# EAGLE board Eddy Backplane (EAGLE 9.5.2)
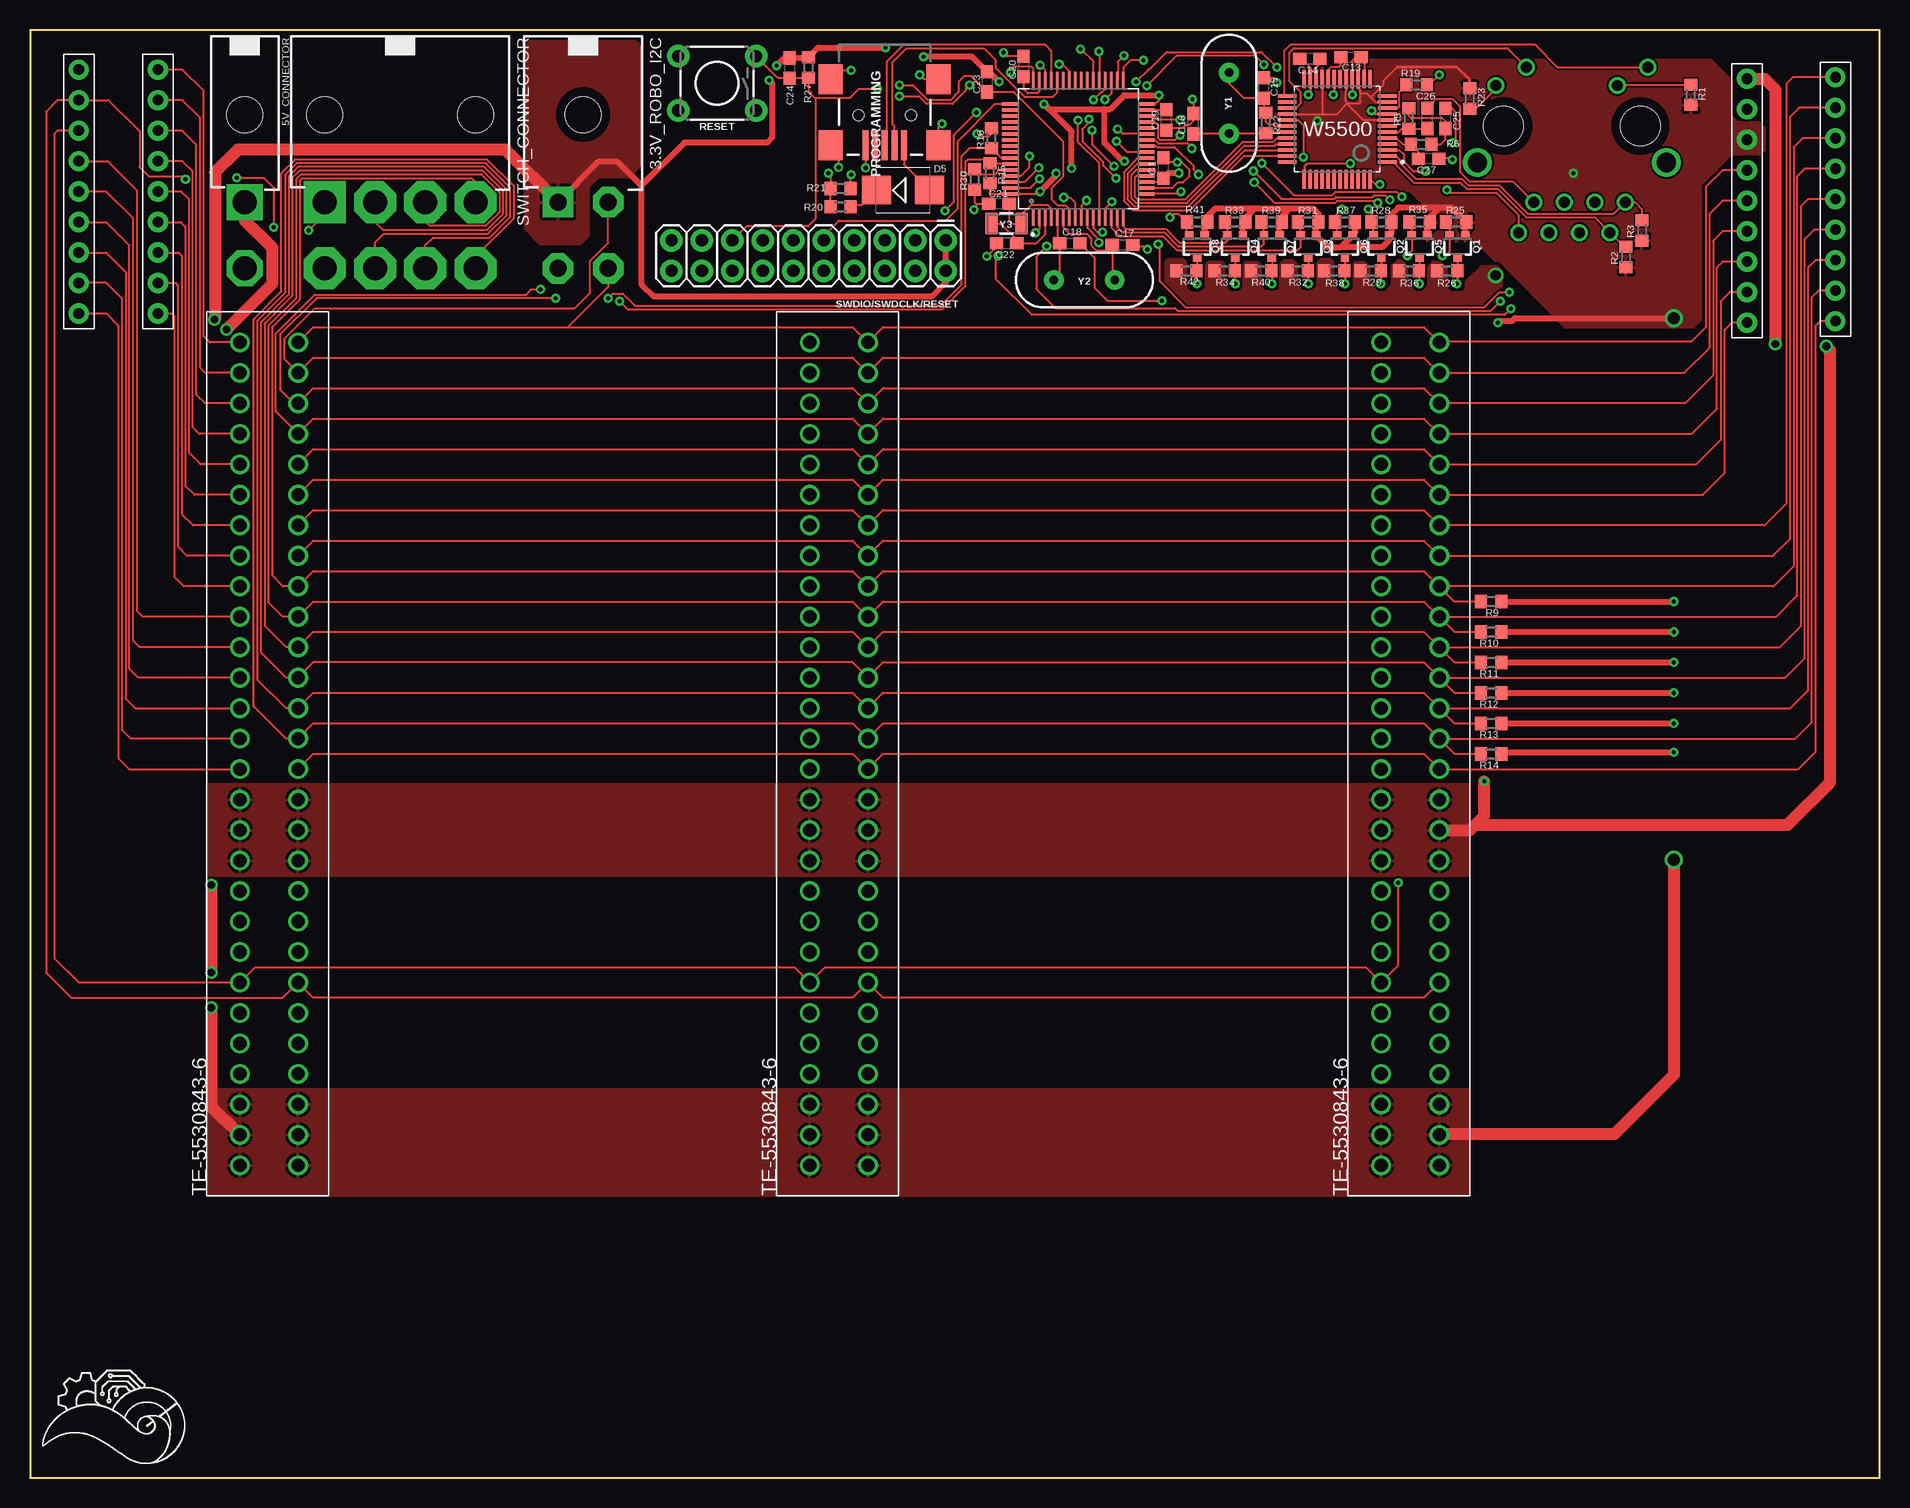
[diagram p3: board, top side]
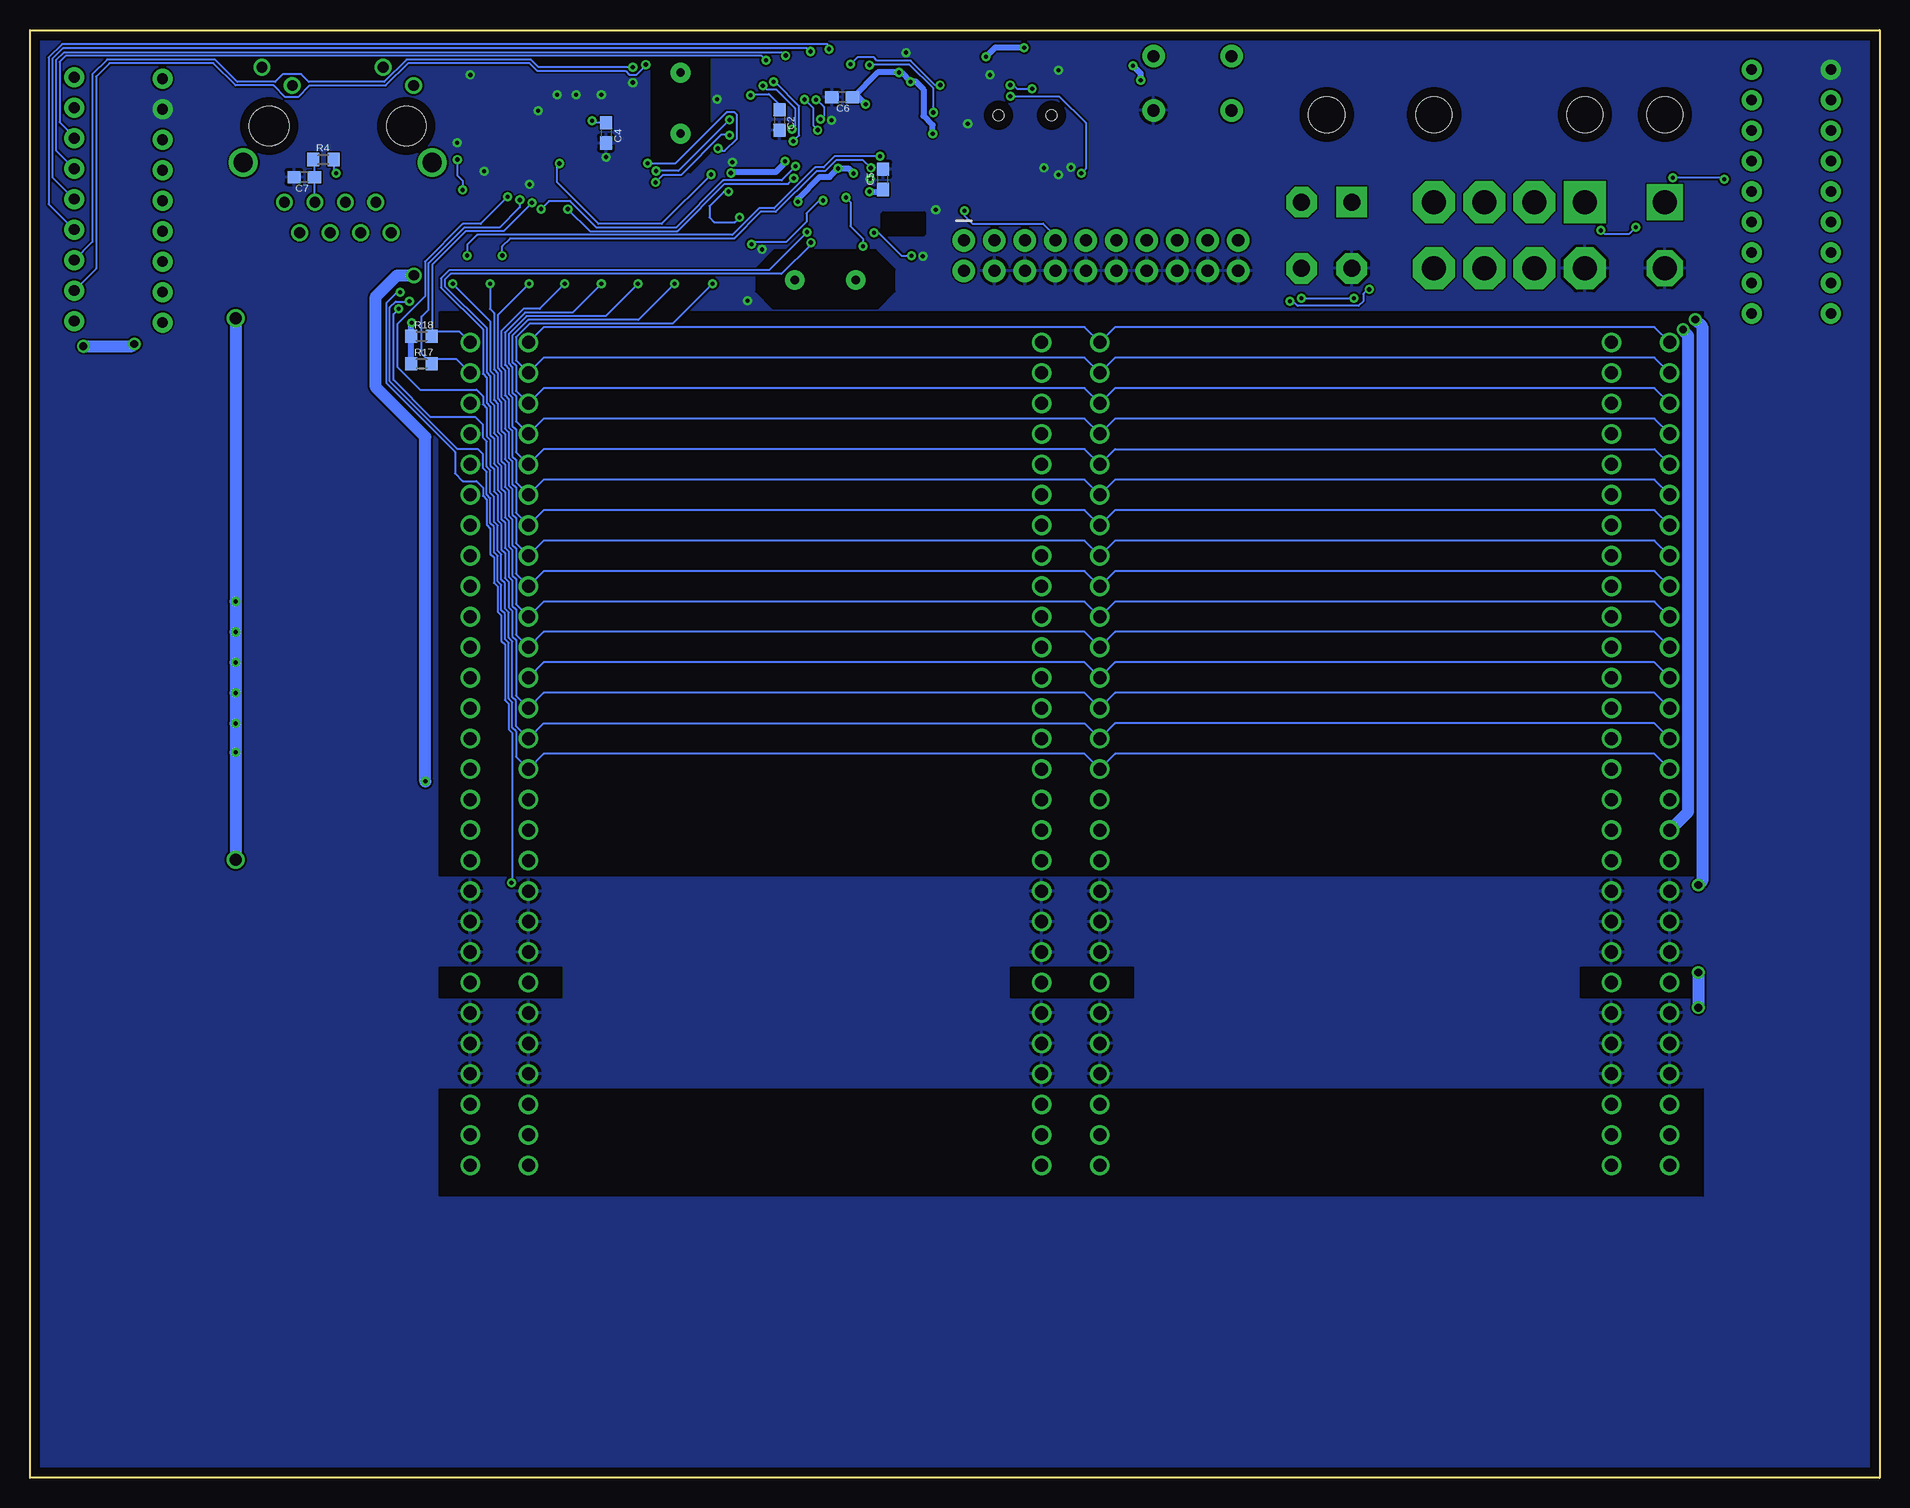
[diagram p4: board, bottom side, seen from below]

Size 154.18 x 120.65 mm. Coordinates in mm from the lower left corner, seen from the top.
Outline: 0,0 154.18,0 154.18,120.65 0,120.65 0,0
Copper layers (1*16): Top 0.035mm / dielectric 1.5mm / Bottom 0.035mm
Design rules "default *": minimum track width 6mil, minimum drill 0.35mm, track to track 6mil, track to pad 6mil, pad to pad 6mil, via to via 6mil, smd to smd 6mil, copper to edge 30mil, drill to drill 6mil, minimum pad ring 10mil, minimum via ring 8mil, stop-mask expansion 4mil, vias tented up to drill 0mil, thermal gap 10mil

## Footprints (pad centres in the part's own frame; a part is rotated, then mirrored left to right if it is on the bottom)
39-30-?04? = drill 1.422 pad 2.54 square: 1 2.095,0 | drill 1.422 pad 2.54 octagon: 2 -2.095,0; 3 2.095,5.512; 4 -2.095,5.512 | hole 3: 0,-7.3
39-30-?02? = drill 2 pad 3 square: 1 0,0 | drill 2 pad 3 octagon: 2 0,5.512 | hole 3: 0,-7.3
C0603 = smd 1.1 x 1: 1 -0.85,0; 2 0.85,0
SMB = smd 2.4 x 2.4: A 2.2,0; C -2.2,0
WIZNET_RB1-125BAG1A = drill 0.9: L1 6.325,-3.38; L2 3.784,-4.899; L3 -3.786,-3.379; L4 -6.325,-4.9 | drill 0.9 pad 1.3: R1 -4.446,6.349; R2 -3.176,8.889; R3 -1.906,6.349; R4 -0.636,8.889; R5 0.634,6.349; R6 1.904,8.889; R7 3.174,6.349; R8 4.444,8.889 | drill 1.6 pad 2.184: S1 -7.876,3.049; S2 7.874,3.049 | hole 3.3: 5.714,-0.001; -5.716,-0.001
USB-MINIB = smd 2.5 x 0.5: D+ 2.5,0; D- 2.5,0.8; GND 2.5,-1.6; ID 2.5,-0.8; VBUS 2.5,1.6 | smd 2.5 x 2: S1 -3,4.5; S2 2.5,4.5; S3 -3,-4.5; S4 2.5,-4.5 | hole 0.9: 0,2.2; 0,-2.2
929852-01-09_1ROW = drill 0.889 pad 1.676: P$1 1.27,1.27; P$2 3.81,1.27; P$3 6.35,1.27; P$4 8.89,1.27; P$5 11.43,1.27; P$6 13.97,1.27; P$7 16.51,1.27; P$8 19.05,1.27; P$9 21.59,1.27
SOT323 = smd 0.7 x 0.7: 1 -0.65,-0.925; 2 0.65,-0.925; 3 0,0.925
R0603 = smd 1 x 1.1: 1 -0.85,0; 2 0.85,0
TACTILE_SWITCH_PTH_6.0MM = drill 1.016 pad 1.88: 1 -3.251,2.261; 2 3.251,2.261; 3 -3.251,-2.261; 4 3.251,-2.261
QFP50P1200X1200X160-64N = smd 1.47 x 0.28: 1 -5.67,3.75; 2 -5.67,3.25; 3 -5.67,2.75; 4 -5.67,2.25; 5 -5.67,1.75; 6 -5.67,1.25; 7 -5.67,0.75; 8 -5.67,0.25; 9 -5.67,-0.25; 10 -5.67,-0.75; 11 -5.67,-1.25; 12 -5.67,-1.75; 13 -5.67,-2.25; 14 -5.67,-2.75; 15 -5.67,-3.25; 16 -5.67,-3.75; 33 5.67,-3.75; 34 5.67,-3.25; 35 5.67,-2.75; 36 5.67,-2.25; 37 5.67,-1.75; 38 5.67,-1.25; 39 5.67,-0.75; 40 5.67,-0.25; 41 5.67,0.25; 42 5.67,0.75; 43 5.67,1.25; 44 5.67,1.75; 45 5.67,2.25; 46 5.67,2.75; 47 5.67,3.25; 48 5.67,3.75 | smd 0.28 x 1.47: 17 -3.75,-5.67; 18 -3.25,-5.67; 19 -2.75,-5.67; 20 -2.25,-5.67; 21 -1.75,-5.67; 22 -1.25,-5.67; 23 -0.75,-5.67; 24 -0.25,-5.67; 25 0.25,-5.67; 26 0.75,-5.67; 27 1.25,-5.67; 28 1.75,-5.67; 29 2.25,-5.67; 30 2.75,-5.67; 31 3.25,-5.67; 32 3.75,-5.67; 49 3.75,5.67; 50 3.25,5.67; 51 2.75,5.67; 52 2.25,5.67; 53 1.75,5.67; 54 1.25,5.67; 55 0.75,5.67; 56 0.25,5.67; 57 -0.25,5.67; 58 -0.75,5.67; 59 -1.25,5.67; 60 -1.75,5.67; 61 -2.25,5.67; 62 -2.75,5.67; 63 -3.25,5.67; 64 -3.75,5.67
2X10 = drill 1.016 pad 1.88: 1 0,0; 2 0,2.54; 3 2.54,0; 4 2.54,2.54; 5 5.08,0; 6 5.08,2.54; 7 7.62,0; 8 7.62,2.54; 9 10.16,0; 10 10.16,2.54; 11 12.7,0; 12 12.7,2.54; 13 15.24,0; 14 15.24,2.54; 15 17.78,0; 16 17.78,2.54; 17 20.32,0; 18 20.32,2.54; 19 22.86,0; 20 22.86,2.54
39-30-?08? = drill 2 pad 3.5 square: 1 6.287,0 | drill 2 pad 3.5 octagon: 2 2.095,0; 3 -2.095,0; 4 -6.287,0; 5 6.287,5.512; 6 2.095,5.512; 7 -2.095,5.512; 8 -6.287,5.512 | hole 3: -6.287,-7.3; 6.287,-7.3
5530843-6-BACKPLANEMATE = drill 1.092: 1 0,4.851; 2 2.54,4.851; 3 5.08,4.851; 4 7.62,4.851; 5 10.16,4.851; 6 12.7,4.851; 7 15.24,4.851; 8 17.78,4.851; 9 20.32,4.851; 10 22.86,4.851; 11 25.4,4.851; 12 27.94,4.851; 13 30.48,4.851; 14 33.02,4.851; 15 35.56,4.851; 16 38.1,4.851; 17 40.64,4.851; 18 43.18,4.851; 19 45.72,4.851; 20 48.26,4.851; 21 50.8,4.851; 22 53.34,4.851; 23 55.88,4.851; 24 58.42,4.851; 25 60.96,4.851; 26 63.5,4.851; 27 66.04,4.851; 28 68.58,4.851; 29 68.58,0; 30 66.04,0; 31 63.5,0; 32 60.96,0; 33 58.42,0; 34 55.88,0; 35 53.34,0; 36 50.8,0; 37 48.26,0; 38 45.72,0; 39 43.18,0; 40 40.64,0; 41 38.1,0; 42 35.56,0; 43 33.02,0; 44 30.48,0; 45 27.94,0; 46 25.4,0; 47 22.86,0; 48 20.32,0; 49 17.78,0; 50 15.24,0; 51 12.7,0; 52 10.16,0; 53 7.62,0; 54 5.08,0; 55 2.54,0; 56 0,0
QFP50P900X900X160-48N = smd 1.56 x 0.28: 1 -4.18,2.75; 2 -4.18,2.25; 3 -4.18,1.75; 4 -4.18,1.25; 5 -4.18,0.75; 6 -4.18,0.25; 7 -4.18,-0.25; 8 -4.18,-0.75; 9 -4.18,-1.25; 10 -4.18,-1.75; 11 -4.18,-2.25; 12 -4.18,-2.75; 25 4.18,-2.75; 26 4.18,-2.25; 27 4.18,-1.75; 28 4.18,-1.25; 29 4.18,-0.75; 30 4.18,-0.25; 31 4.18,0.25; 32 4.18,0.75; 33 4.18,1.25; 34 4.18,1.75; 35 4.18,2.25; 36 4.18,2.75 | smd 0.28 x 1.56: 13 -2.75,-4.18; 14 -2.25,-4.18; 15 -1.75,-4.18; 16 -1.25,-4.18; 17 -0.75,-4.18; 18 -0.25,-4.18; 19 0.25,-4.18; 20 0.75,-4.18; 21 1.25,-4.18; 22 1.75,-4.18; 23 2.25,-4.18; 24 2.75,-4.18; 37 2.75,4.18; 38 2.25,4.18; 39 1.75,4.18; 40 1.25,4.18; 41 0.75,4.18; 42 0.25,4.18; 43 -0.25,4.18; 44 -0.75,4.18; 45 -1.25,4.18; 46 -1.75,4.18; 47 -2.25,4.18; 48 -2.75,4.18
HC49US = drill 0.7 pad 1.651: 1 -2.54,0; 2 2.54,0
CRYSTAL-SMD-3.2X1.5MM = smd 1 x 1.8: P$1 -1.25,0; P$2 1.25,0

## Placement (x,y rotation side)
3.3V_ROBO_I2C  39-30-04?_S  [39-30-?04?]  46.1,106.3 180 top
5V_CONNECTOR  39-30-02?_S  [39-30-?02?]  17.91,106.3 180 top
C1  0.1 uF  [C0603]  94.49,109.16 90 top
C2  0.1 uF  [C0603]  91.69,113.16 270 bottom
C4  0.1 uF  [C0603]  106.17,112.08 270 bottom
C5  0.1 uF  [C0603]  83.06,108.2 90 bottom
C6  0.1 uF  [C0603]  86.49,115.06 180 bottom
C7  22nF  [C0603]  131.32,108.39 180 bottom
C13  4.7uF  [C0603]  110.11,118.36 0 top
C14  10nF  [C0603]  106.68,118.24 180 top
C15  18pF  [C0603]  102.87,115.82 90 top
C16  18pF  [C0603]  96.96,112.84 90 top
C17  18pF  [C0603]  91.06,102.74 0 top
C18  18pF  [C0603]  86.68,102.87 0 top
C19  2.2uF  [C0603]  94.74,113.16 90 top
C20  2.2uF  [C0603]  82.8,117.6 270 top
C21  12.5pF  [C0603]  80.77,106.17 180 top
C22  12.5pF  [C0603]  81.41,102.87 180 top
C23  0.1uF  [C0603]  79.76,116.33 270 top
C24  0.1uF  [C0603]  63.31,117.47 270 top
C25  10nF  [C0603]  117.98,113.28 270 top
C26  6.8nF  [C0603]  116.46,113.28 90 top
C27  6.8nF  [C0603]  116.59,109.92 180 top
D5  [SMB]  72.77,107.31 0 top
P2  RB1-125BAG1A  [WIZNET_RB1-125BAG1A]  128.52,112.65 180 top
PROGRAMMING  USB_MINI-B_SMT  [USB-MINIB]  71.25,113.54 270 top
PWR_ON  929870-01-09_3  [929852-01-09_1ROW]  5.33,95.76 90 top
Q1  310mA/60V/1.6Ω  [SOT323]  119,102.62 180 top
Q2  310mA/60V/1.6Ω  [SOT323]  112.65,102.62 180 top
Q3  310mA/60V/1.6Ω  [SOT323]  106.55,102.62 180 top
Q4  310mA/60V/1.6Ω  [SOT323]  100.46,102.62 180 top
Q5  310mA/60V/1.6Ω  [SOT323]  115.82,102.62 180 top
Q6  310mA/60V/1.6Ω  [SOT323]  109.6,102.62 180 top
Q7  310mA/60V/1.6Ω  [SOT323]  103.5,102.62 180 top
Q8  310mA/60V/1.6Ω  [SOT323]  97.28,102.62 180 top
R1  330  [R0603]  138.43,115.25 270 top
R2  49  [R0603]  133.03,101.73 90 top
R3  49  [R0603]  134.37,103.95 90 top
R4  10  [R0603]  129.73,109.86 180 bottom
R5  82  [R0603]  114.94,113.28 90 top
R6  82  [R0603]  115.95,111.12 0 top
R9  10k  [R0603]  121.79,73.03 180 top
R10  10k  [R0603]  121.79,70.48 180 top
R11  10k  [R0603]  121.79,67.94 180 top
R12  10k  [R0603]  121.79,65.41 180 top
R13  10k  [R0603]  121.79,62.87 180 top
R14  10k  [R0603]  121.79,60.33 180 top
R15  4.7k  [R0603]  80.01,108.71 90 top
R16  4.7k  [R0603]  80.14,111.63 270 top
R17  4.7k  [R0603]  121.54,92.84 0 bottom
R18  4.7k  [R0603]  121.54,95.12 0 bottom
R19  12.4k  [R0603]  115.57,116.08 180 top
R20  10k  [R0603]  67.56,105.92 180 top
R21  33k  [R0603]  67.56,107.44 0 top
R22  1M  [R0603]  103,112.9 270 top
R23  330  [R0603]  120.02,114.94 90 top
R25  10k  [R0603]  118.87,104.65 180 top
R26  10k  [R0603]  118.11,100.58 0 top
R27  4.7k  [R0603]  64.9,117.54 90 top
R28  10k  [R0603]  112.65,104.65 180 top
R29  10k  [R0603]  111.76,100.58 0 top
R30  100k  [R0603]  78.74,108.2 270 top
R31  10k  [R0603]  106.55,104.65 180 top
R32  10k  [R0603]  105.66,100.58 0 top
R33  10k  [R0603]  100.46,104.65 180 top
R34  10k  [R0603]  99.57,100.58 0 top
R35  10k  [R0603]  115.82,104.65 180 top
R36  10k  [R0603]  114.94,100.58 0 top
R37  10k  [R0603]  109.6,104.65 180 top
R38  10k  [R0603]  108.71,100.58 0 top
R39  10k  [R0603]  103.5,104.65 180 top
R40  10k  [R0603]  102.62,100.58 0 top
R41  10k  [R0603]  97.28,104.65 180 top
R42  10k  [R0603]  96.39,100.58 0 top
RESET  MOMENTARY-SWITCH-SPST-PTH-6.0MM  [TACTILE_SWITCH_PTH_6.0MM]  57.28,116.2 180 top
STM32  STM32F405RGT6  [QFP50P1200X1200X160-64N]  87.38,110.74 90 top
SWDIO/SWDCLK/RESET  [2X10]  76.33,103.12 180 top
SWITCH_CONN  929870-01-09_1  [929852-01-09_1ROW]  151.76,95.12 90 top
SWITCH_CONNECTOR  39-30-08?_S  [39-30-?08?]  30.86,106.3 180 top
U$1  5530843-FEMALE  [5530843-6-BACKPLANEMATE]  69.85,26.04 90 top
U$2  5530843-FEMALE  [5530843-6-BACKPLANEMATE]  22.35,26.04 90 top
U$3  5530843-FEMALE  [5530843-6-BACKPLANEMATE]  117.47,26.04 90 top
U$6  929870-01-09_2  [929852-01-09_1ROW]  9.4,118.62 270 top
U$8  929870-01-09_4  [929852-01-09_1ROW]  144.4,95 90 top
W5500  W5500  [QFP50P900X900X160-48N]  108.97,112.39 180 top
Y1  25Mhz  [HC49US]  99.95,114.55 90 top
Y2  12MHz  [HC49US]  87.88,99.82 180 top
Y3  32.768kHz  [CRYSTAL-SMD-3.2X1.5MM]  81.41,104.52 180 top

## Tracks (layer width: path | path; a pad name or v marks a point on that pad's centre or on a via)
3.3V  (via drill 0.35, 0.65 pad 1, 1 pad 0.9, 1 pad 1.3)
  Top 0.152: v90.17,106.34 89.63,105.8 STM32.13 | STM32.32 93.83,114.49 94.11,114.77 v94.11,115.22 | v84.2,107.19 v84.2,107.18 84.18,107.18 83.99,106.99 STM32.64 80.14,106.99 80.01,107.12 R15.1 | STM32.48 83.63,117.42 83.45,117.59 82.04,117.59 81.73,117.28 81.74,117.27 v81.74,117.11 | R41.1 98.07,104.65 97.93,104.51 | R33.1 101.24,104.65 101.11,104.51 | 104.16,104.45 R39.1 | R31.1 107.4,104.46 107.2,104.26 | 113.36,103.61 Q2.1 | STM32.19 94.17,107.99 C1.1 | C23.1 79.95,117.18 | R16.1 80.14,112.01 79.88,111.76 79.18,111.76 v78.93,112.01 | W5500.15 110.72,115.82 110.91,115.63 110.91,115.38 | 64.83,118.33 R27.2 | 109.86,114.55 109.79,114.55 109.63,114.72 109.63,115.5 109.72,115.59 W5500.17 | 109.86,114.55 110.81,114.55 110.91,114.66 110.91,115.38 | 110.91,115.38 111.44,115.38 111.76,115.06 | W5500.11 112.18,114.64 111.76,115.06 | 111.76,115.06 112.84,116.14 112.84,116.46 113.94,117.56 | W5500.28 107.63,113.64 | 107.63,113.64 108.95,113.64 109.79,114.49 | 109.79,114.49 109.86,114.55 | W5500.21 107.72,113.73 107.63,113.64 | W5500.8 111.14,113.14 109.79,114.49 | 50.99,107.7 50.93,107.7
  Top 0.254: R23.2 120.02,116.48 118.94,117.56 113.94,117.56
  Top 0.508: Q8.1 97.93,104.51 | Q4.1 101.11,104.51 | Q7.1 104.16,104.45 | Q5.1 116.47,104.45 R35.1 116.67,105.05 117.47,105.86 | Q1.1 119.65,104.58 R25.1 118.52,105.86 117.47,105.86 | SWDIO/SWDCLK/RESET.1 SWDIO/SWDCLK/RESET.2 76.33,99.57 75.18,98.42 52.01,98.42 50.99,99.44 50.99,107.7 54.56,111.27 61.47,111.27 61.87,111.67 61.87,116.18 v61.59,116.46 | 89.53,114.05 84.93,114.05 v84.52,114.45 84.58,114.45 86.83,112.2 v86.83,109.11 | 89.53,114.05 90.04,114.05 91.21,115.22 v94.11,115.22 | 79.95,117.18 v80.79,116.35 | C23.1 78.51,118.43 v74.49,118.43 | C1.1 94.92,108.73 v95.76,108.73 | 89.53,114.05 89.56,114.02 89.56,111.25 91.1,109.71 v91.23,109.71 | 109.27,102.56 109.26,102.55 108.19,102.55 Q3.1 107.2,104.26 | 109.27,102.56 Q6.1 110.45,103.74 R37.1 | 113.36,103.61 113.5,103.74 R28.1 113.5,105.31 114.05,105.86 117.47,105.86 | Q2.1 113.3,103.14 112.72,102.56 109.27,102.56 | R41.1 98.13,105.12 98.81,105.79 102.11,105.79 | 102.11,105.79 105.03,105.79 | 105.03,105.79 106.93,105.79 107.4,105.32 107.4,104.46 | R33.1 101.31,104.99 102.11,105.79 | R39.1 104.36,105.12 105.03,105.79 | R14.1 122.77,60.45 v137.03,60.45 | 64.83,118.33 C24.1 62.89,118.33 v62.23,117.67 | R27.2 65.69,119.18 v71.31,119.18 | v122.36,96.27 122.52,96.42 123.56,96.42 123.79,96.65 v137.03,96.65 | R13.1 v137.03,62.87 | R12.1 v137.03,65.41 | R11.1 v137.03,67.94 | R10.1 v137.03,70.48 | R9.1 v137.03,73.03 | v84.2,107.19 85.54,108.52 v85.54,108.7 | 50.93,107.7 48.96,109.67 47.37,109.67 3.3V_ROBO_I2C.1
  Top 1.016: v15.11,49.4 v15.11,42.1 | v15.11,39.18 15.11,30.96 U$2.2 | 3.3V_ROBO_I2C.1 39.62,110.68 17.34,110.68 15.43,108.78 15.43,96.58 v15.37,96.52 | v137.03,51.5 137.03,33.59 132.08,28.64 117.54,28.64
  Top 1.27: U$3.55 117.54,28.64
  Bottom 0.152: C2.1 91.69,114.43 92.58,115.32 94.01,115.32 v94.11,115.22 | 83.22,107.19 C5.1 | 85.12,115.06 C6.1 | C4.1 107.15,112.93 v107.31,113.09 | R4.1 128.88,108.94 v128.65,108.71
  Bottom 0.508: v84.2,107.19 83.22,107.19 | v84.52,114.45 85.12,115.06 | v95.76,108.73 95.69,108.8 92.02,108.8 91.23,109.59 v91.23,109.71 | C6.1 85.56,115.06 83.52,117.11 v81.74,117.11 81.55,117.11 v80.79,116.35 80.34,116.35 79.71,115.71 79.71,113.49 78.93,112.72 v78.93,112.01 | v71.31,119.18 73.73,119.18 v74.49,118.43 | v62.23,117.67 61.59,117.03 v61.59,116.46 | v122.36,96.27 122.39,96.27 R18.1 R17.1 | v90.17,106.34 90.17,106.59 88.35,108.42 87.53,108.42 v86.83,109.11 85.95,109.11 v85.54,108.7
  Bottom 1.016: v15.11,42.1 v15.11,39.18 | v15.37,96.52 14.8,95.95 14.8,49.72 v15.11,49.4 | v137.03,96.65 v137.03,73.03 v137.03,70.48 v137.03,67.94 v137.03,65.41 v137.03,62.87 v137.03,60.45 v137.03,51.5
  pour Top: 14.73,32.38 14.73,23.5 120.02,23.5 120.02,32.38
  pour Top: 119.89,118.17 103.82,118.17 103.7,118.05 103.7,108.14 104.52,107.31 104.58,107.25 115,107.25 116.2,106.05 116.2,103.31 116.46,103.06 120.46,103.06 122.11,101.41 122.43,101.41 127.95,95.89 132.21,95.89 138.68,95.89 139.32,96.52 139.32,107.76 139.64,108.08 141.86,110.3 143.07,110.3 144.27,110.3 144.65,110.68 144.65,112.46 144.27,112.84 144.15,112.97 142.37,112.97 141.86,113.47 141.86,114.68 141.86,116.46 140.14,118.17
  pour Top: 41.21,104.08 42.48,102.81 42.55,102.81 45.91,102.81 46.61,103.5 46.61,107.57 47.43,108.39 49.97,108.39 50.99,109.41 50.99,110.49 50.99,119.25 50.74,119.51 50.16,120.08 50.1,120.08 42.04,120.08 41.66,119.7 41.21,119.25 41.21,119.19
3.3V_ON/OFF  (via drill 0.35)
  Top 0.152: PWR_ON.P$1 6.35,97.03 7.37,96.01 7.37,59.94 8.26,59.05 U$2.14 | STM32.8 87.13,106.25 86.68,106.69 v86.17,106.69 | v122.56,98.04 121.73,97.22 95.69,97.22 95.44,97.47 85.47,97.47 83.88,99.06 83.88,101.76 v84.75,102.62
  Bottom 0.152: U$2.14 18.77,60.33 63.73,60.33 U$1.14 66.27,60.33 111.35,60.33 U$3.14 113.67,60.1 113.67,62.21 113.98,62.52 113.98,64.62 114.28,64.93 114.28,69.58 114.59,69.88 114.59,71.99 114.89,72.3 114.89,74.41 115.19,74.71 115.19,76.82 115.5,77.12 115.5,79.23 115.81,79.54 115.81,81.65 116.11,81.95 116.11,83.83 116.42,84.14 116.42,85.3 116.84,85.72 118.54,85.72 124.18,91.36 124.18,97.53 123.69,98.02 122.58,98.02 v122.56,98.04 | v86.17,106.69 85.79,106.31 85.79,104.3 84.75,103.26 v84.75,102.62
5V  (via drill 0.35, 0.65 pad 0.9, 0.65 pad 1, 0.85 pad 0.9)
  Top 1.016: U$8.P$9 144.59,116.59 145.48,115.7 v145.48,94.49 | 5V_CONNECTOR.1 17.91,104.78 20.19,102.49 20.19,99.5 v16.38,95.69 | U$3.45 120.02,53.98 120.46,54.42 | 120.46,54.42 121.22,55.18 v121.22,58.04 | 120.46,54.42 146.49,54.42 150.05,57.98 150.05,93.98 v149.73,94.3
  Bottom 1.016: v149.73,94.3 145.67,94.3 v145.48,94.49 | v121.22,58.04 121.22,86.75 125.35,90.88 125.35,98.42 123.57,100.2 v122.17,100.2 | v16.38,95.69 16.38,95.59 15.96,95.17 15.96,55.51 U$2.12
  pour Top (no thermals): 96.39,100.58 96.39,101.28 96.2,101.47 96.14,101.54 94.81,101.54 94.61,101.35 94.61,100.77 94.61,99.63 95.69,98.55 96.52,97.73 98.23,97.73 121.09,97.73 122.75,99.38 122.75,100.52 122.68,100.58 122.3,100.97 121.67,100.97 120.97,100.97 119.82,99.82 119.63,99.63 119.63,99.06 119.38,98.81 118.43,98.81 118.11,99.12 118.11,100.77 117.54,101.35 116.97,101.35 116.52,100.9 116.52,100.46 116.52,99.31 116.01,98.81 115.57,98.81 115,99.38 114.81,99.57 114.81,100.97 114.3,101.47 113.98,101.47 113.47,100.97 113.47,100.77 113.47,99.38 113.22,99.12 112.9,98.81 112.39,98.81 111.7,99.5 111.7,100.08 111.7,100.84 111.25,101.28 110.43,101.28 110.3,101.16 110.3,100.33 110.3,99.12 109.92,98.74 109.22,98.74 109.09,98.87 108.65,99.31 108.65,100.77 108.65,101.35 108.46,101.54 107.95,101.54 107.57,101.54 107.31,101.28 107.25,101.22 107.25,100.01 107.25,99.25 106.87,98.87 106.11,98.87 105.66,99.31 105.66,99.89 105.66,101.09 105.54,101.22 105.28,101.47 104.52,101.47 104.27,101.22 104.27,101.16 104.14,101.03 104.14,100.14 104.14,99.12 104.2,99.06 104.01,98.87 103,98.87 102.62,99.25 102.62,99.89 102.62,101.09 102.43,101.28 101.28,101.28 101.22,101.22 101.09,101.09 101.09,100.71 101.09,99.69 101.09,99.12 100.77,98.81 100.08,98.81 99.63,99.25 99.57,99.25 99.57,100.46 99.57,101.16 99.5,101.22 99.38,101.35 98.49,101.35 98.23,101.35 98.11,101.22 97.98,101.09 97.98,100.39 97.98,99.63 97.98,99.19 97.54,98.74 97.54,98.68 97.47,98.74 96.77,98.74 96.46,99.06 96.39,99.12 96.39,100.52
  pour Top: 17.53,57.78 14.73,57.78 14.73,50.16 120.02,50.16 120.02,57.66 120.02,57.78 117.22,57.78
5V_ON/OFF  (via drill 0.35)
  Top 0.152: U$2.15 8.38,61.59 7.67,62.31 7.67,98.25 6.35,99.57 PWR_ON.P$2 | STM32.2 84.13,104.06 v83.82,103.76 | v123.44,97.41 122.94,96.9 83.5,96.9 80.52,99.89 80.52,101.65 v80.71,101.84
  Bottom 0.152: U$2.15 18.77,62.87 63.73,62.87 U$1.15 66.27,62.87 111.35,62.87 U$3.15 113.67,62.64 113.67,64.75 113.98,65.06 113.98,69.7 114.28,70.01 114.28,72.12 114.59,72.42 114.59,74.53 114.89,74.84 114.89,76.95 115.19,77.25 115.19,79.36 115.5,79.67 115.5,81.77 115.81,82.08 115.81,83.96 116.11,84.26 116.11,86.37 116.42,86.68 116.42,87.76 117.05,88.39 120.78,88.39 123.88,91.49 123.88,96.98 v123.44,97.41 | v83.82,103.76 83.45,103.76 81.53,101.84 v80.71,101.84 | v80.71,101.84
12V_ON/OFF  (via drill 0.35)
  Top 0.152: PWR_ON.P$3 6.35,102.11 7.98,100.48 7.98,64.92 8.76,64.14 U$2.16 | STM32.26 93.75,111.49 94.04,111.2 96.51,111.2 96.84,110.87 v96.84,110.77 | v114.36,106.74 113.93,107.17 108.85,107.17 108.56,106.88 105.36,106.88 v102.69,109.56
  Bottom 0.152: U$2.16 18.77,65.41 63.73,65.41 U$1.16 66.27,65.41 111.35,65.41 U$3.16 113.67,65.18 113.67,69.83 113.98,70.14 113.98,72.25 114.28,72.55 114.28,74.66 114.59,74.96 114.59,77.07 114.89,77.38 114.89,79.49 115.19,79.79 115.19,81.9 115.5,82.2 115.5,84.08 115.81,84.39 115.81,86.5 116.11,86.8 116.11,89.14 116.42,89.45 116.42,90.13 116.97,90.68 121.67,90.68 123.57,92.58 123.57,96.14 121.26,98.45 121.26,101.34 118.11,104.5 116.61,104.5 v114.36,106.74 | v96.84,110.77 96.65,110.58 96.27,110.58 95.25,111.6 95.25,113.6 95.44,113.79 96.11,113.79 100.35,109.56 v102.69,109.56
ACOUSTIC_ON/OFF
  Top 0.152: U$2.17 9.02,66.67 8.28,67.41 8.28,102.72 6.35,104.65 PWR_ON.P$4
  Bottom 0.152: U$2.17 18.77,67.94 63.73,67.94 U$1.17 66.27,67.94 111.35,67.94 U$3.17
BACKPLANE_SCL  (via drill 0.35)
  Top 0.152: U$8.P$4 141.1,103.89 140.31,103.1 140.31,91.89 137.96,89.53 U$3.31 116.2,90.81 71.12,90.81 U$1.31 68.58,90.81 23.62,90.81 U$2.31 22,89.53 20.85,90.68 20.85,95.28 23.88,98.3 v43.81,98.3 | STM32.58 80.95,109.99 80.27,110.67 80.25,110.67 R16.2 78.32,110.78 77.65,110.11 77.65,99.42 75.9,97.66 50.42,97.66 49.4,98.68 48.58,98.68 v48.2,98.3
  Bottom 0.152: v48.2,98.3 v43.81,98.3
BACKPLANE_SDA  (via drill 0.35)
  Top 0.152: U$8.P$3 141.1,101.35 140.61,100.86 140.61,89.09 138.52,87 U$3.32 116.2,88.27 71.12,88.27 U$1.32 68.58,88.27 23.62,88.27 U$2.32 20.47,88.88 20.47,95.33 23.75,98.6 41.35,98.6 41.78,99.03 v42.55,99.03 | STM32.59 80.08,109.49 R15.2 79.72,109.86 78.17,109.86 77.95,109.64 77.95,99.29 76.02,97.36 49.84,97.36 v49.15,98.04
  Bottom 0.152: v42.55,99.03 42.67,99.03 43.05,98.65 43.05,98.04 43.43,97.66 48.51,97.66 48.9,98.04 v49.15,98.04
CONTROL_SIGNAL  (via drill 0.35)
  Top 0.152: U$2.7 17.51,41.29 | 17.51,41.29 18.77,42.55 63.73,42.55 U$1.7 66.27,42.55 111.35,42.55 U$3.7 114.05,42.7 v114.05,49.59 | PWR_ON.P$7 2.29,112.27 2.03,112.01 2.03,43.31 4.05,41.29 17.51,41.29 | v123.32,98.81 122.46,98.81 121.18,97.52 96.34,97.52 94.17,99.69 94.17,102.68 v94.04,102.81 | v88.07,106.44 87.63,106 STM32.9
  Bottom 0.152: v123.32,98.81 123.57,98.81 124.48,97.89 124.48,91.24 118.75,85.5 118.75,83.69 118.11,83.06 116.97,83.06 116.42,82.51 116.42,81.83 116.11,81.52 116.11,79.41 115.81,79.11 115.81,77 115.5,76.69 115.5,74.58 115.19,74.28 115.19,72.17 114.89,71.87 114.89,69.76 114.59,69.45 114.59,64.8 114.28,64.5 114.28,62.39 113.98,62.09 113.98,49.66 v114.05,49.59 | v94.04,102.81 93.85,103 91.12,103 89.47,104.65 89.47,105.36 88.39,106.44 v88.07,106.44
D+
  Top 0.152: PROGRAMMING.D+ 71.44,111.23 71.44,118.04 72.81,119.41 84.65,119.41 85.12,118.94 STM32.45
D-
  Top 0.152: PROGRAMMING.D- 72.05,112.63 71.86,112.82 71.86,117.9 73.06,119.11 79.52,119.11 80.52,118.11 80.52,117.47 82.93,115.06 85.22,115.06 85.63,115.47 STM32.44
GND  (via drill 0.35)
  Top 0.152: C20.1 81.47,118.45 v81.15,118.77 | PROGRAMMING.S1 74.53,116.54 v74.17,116.9 | PROGRAMMING.S2 75.75,112.58 v76.01,112.84 | PROGRAMMING.S3 67.49,117.28 v68.45,117.28 | C22.2 80.39,102.7 80.39,102.42 v79.76,101.79 | R30.2 78.74,106.3 78.87,106.17 | 78.87,106.17 C21.2 | 78.87,106.17 78.87,105.86 v78.68,105.66 | v117.47,116.9 116.65,116.08 R19.1 | C25.1 118.53,114.13 118.81,113.86 118.81,111.47 v118.58,111.25 | C14.2 106.05,118.24 106.72,117.57 W5500.23 106.72,115.42 v106.55,115.25 | W5500.19 108.72,115.32 v108.65,115.25 | v110.24,115.25 110.22,115.27 W5500.16 110.17,116.62 110.17,118.05 110.3,118.17 110.77,118.17 C13.2 111.22,118.11 W5500.14 | C1.2 94.87,109.63 95.62,109.63 v95.63,109.64 96.01,109.64 96.65,109 96.65,108.48 96.12,107.95 95.69,107.95 95.24,107.49 STM32.18 | v96.9,114.87 96.97,114.81 C16.2 96.97,113.09 96.64,112.77 96.37,112.77 96.24,112.63 96.24,112.62 96.14,112.52 94.96,112.52 C19.1 | STM32.12 89.13,109.53 87.37,111.29 v87.37,113.13 | STM32.63 83.4,107.49 v84.15,108.25 | R21.2 68.41,108.55 v68.45,108.58 | 91.91,102.62 91.85,102.55 91.85,102.68 C17.2 92.04,102.62 92.9,102.62 v93.15,102.36 | C18.2 88.71,101.69 88.71,99.19 89.82,98.08 v94.36,98.08 | C15.2 103.61,116.67 103.92,116.36 v103.92,116.27 | W5500.29 105.74,113.14 106.16,112.73 v106.16,110.06 | W5500.9 112.11,113.64 v111.83,113.92 | W5500.48 112.15,107.78 v112.52,107.78 | W5500.3 114.14,110.64 114.51,110.28 114.51,109.7 115.33,108.89 v116.33,108.89 | PROGRAMMING.GND 69.65,109.17 v69.66,109.16 | PROGRAMMING.S4 67.41,110.37 v67.41,109.2
  pour Bottom: 0,120.65 0,0 154.18,0 154.18,120.65
ISOLATION
  cutout Bottom: 14.73,97.16 14.73,50.16 120.02,50.16 120.02,97.16
  cutout Bottom: 17.53,32.38 14.73,32.38 14.73,23.5 120.02,23.5 120.02,32.38
  cutout Bottom: 101.03,120.27 98.87,120.27 97.54,118.94 97.54,110.36 99.12,108.78 101.09,108.78 102.36,110.05 102.36,118.94
  cutout Bottom: 82.11,98.87 82.11,100.71 83.69,102.3 92.14,102.3 93.66,100.77 93.66,98.87 92.27,97.47 83.5,97.47
  cutout Bottom: 79.57,105.41 79.57,103.63 79.69,103.5 83.06,103.5 83.19,103.63 83.19,105.35 83.06,105.47 79.63,105.47
JETSON_ON/OFF  (via drill 0.35)
  Top 0.152: U$2.18 9.14,69.22 8.59,69.77 8.59,104.95 6.35,107.19 PWR_ON.P$5 | STM32.11 88.63,104.16 88.98,103.81 v89.41,103.81
  Bottom 0.152: U$2.18 18.77,70.48 63.73,70.48 U$1.18 66.27,70.48 111.35,70.48 U$3.18 113.67,70.26 113.67,72.37 113.98,72.68 113.98,74.78 114.28,75.09 114.28,77.2 114.59,77.5 114.59,79.61 114.89,79.92 114.89,82.03 115.19,82.33 115.19,84.21 115.5,84.52 115.5,86.62 115.81,86.93 115.81,89.27 116.11,89.57 116.11,91.68 116.42,91.98 116.42,95.69 119.91,99.19 119.91,99.95 119.22,100.64 92.58,100.64 v89.41,103.81
KILL_SWITCH  (via drill 0.35)
  Top 0.152: U$3.37 116.2,75.56 71.12,75.56 U$1.37 68.58,75.56 23.62,75.56 U$2.37 21.08,74.3 20.17,75.21 20.17,95.86 22.48,98.17 22.48,108.08 22.68,108.28 36.83,108.28 37.15,107.96 SWITCH_CONNECTOR.4 | U$3.37 145.35,74.3 147.01,75.96 147.01,110.88 147.76,111.63 SWITCH_CONN.P$7 | R9.2 118.75,73.03 U$3.37 | STM32.33 91.13,117.54 91.71,118.13 v92.82,118.13
  Bottom 0.152: SWITCH_CONN.P$7 150.5,111.76 151.71,112.98 151.71,117.98 151.21,118.49 93.19,118.49 v92.82,118.13
MOBO_ON/OFF  (via drill 0.35)
  Top 0.152: U$2.19 9.4,71.75 8.89,72.26 8.89,107.31 6.48,109.73 PWR_ON.P$6 | STM32.10 88.13,104.15 89.09,103.19 v89.09,102.93
  Bottom 0.152: U$2.19 18.77,73.03 63.73,73.03 U$1.19 66.27,73.03 111.35,73.03 U$3.19 113.67,72.8 113.67,74.91 113.98,75.22 113.98,77.33 114.28,77.63 114.28,79.74 114.59,80.04 114.59,82.15 114.89,82.46 114.89,84.34 115.19,84.64 115.19,86.75 115.5,87.06 115.5,89.39 115.81,89.7 115.81,91.81 116.11,92.11 116.11,95.82 119.61,99.32 119.61,99.82 119.09,100.33 91.53,100.33 89.09,102.77 v89.09,102.93
N$1
  Bottom 0.152: P2.R3 130.43,108.36 C7.1 130.47,109.74 R4.2
N$3
  cutout Bottom: 14.73,42.55 14.73,40.01 24.89,40.01 24.89,42.55
N$4
  Top 0.152: W5500.22 107.22,117.5 107.53,117.82 C14.1
N$5
  cutout Bottom: 62.23,42.55 62.23,40.01 72.39,40.01 72.39,42.55
N$6
  cutout Bottom: 109.86,42.55 109.86,40.01 120.02,40.01 120.02,42.55
N$8
  Top 0.152: R20.1 68.54,106.05 69.3,106.05 D5.C
N$9
  Top 0.152: W5500.30 103.78,112.64 103.64,112.78 103.25,112.78 103,113.03 R22.1 102.87,113.88 C15.1 101.18,114.97 99.95,116.2 Y1.2
N$10
  Top 0.152: C16.1 99.92,111.99 Y1.1 99.99,112.05 R22.2 103.09,112.14 W5500.31
N$11
  Top 0.152: W5500.25 104.53,115.4 104.53,118.88 105.09,119.44 125.43,119.44 127.33,117.55 P2.L4
N$12
  Top 0.152: W5500.27 105.53,114.14 105.8,114.41 105.8,114.43 105.92,114.55 105.92,115.44 104.96,116.4 104.96,118.74 105.36,119.14 123.15,119.14 P2.L2
N$13
  Top 0.152: W5500.20 108.22,117.32 108.48,117.58 109.08,117.58 109.26,117.77 C13.1
N$14
  Top 0.152: W5500.10 114.02,114.14 114.16,114.28 114.16,115.51 R19.2
N$15
  Top 0.152: P2.L1 122.2,115.76 120.52,114.08 R23.1
N$16
  Top 0.152: P2.L3 132.38,116.1 R1.1
N$17
  Top 0.152: C17.1 90.21,102.62 | 90.21,102.62 90.21,100.04 Y2.1 | STM32.6 86.13,104.18 86.65,103.66 88.11,103.66 88.46,103.31 88.46,102.71 88.87,102.3 89.89,102.3 90.21,102.62
N$18
  Top 0.152: STM32.5 85.63,103.07 C18.1 85.83,100.31 Y2.2
N$19
  Top 0.152: C20.2 82.8,115.75 83.19,115.37 83.95,115.37 84.13,115.55 STM32.47
N$20
  Top 0.152: STM32.31 94.73,113.99 C19.2
N$21
  Top 0.152: STM32.4 85.13,105.75 84.84,106.05 83.42,106.05 82.66,105.28 Y3.P$1 81.92,104.52 81.62,104.81 C21.1
N$22
  Top 0.152: R6.2 117.6,111.12 117.98,111.51 C25.2 117.98,113.03 117.73,113.28 115.13,113.28 114.94,113.47 R5.2
N$23
  Top 0.152: W5500.2 113.89,110.14 114.16,109.88 114.16,109.62 115.54,108.23 119.36,108.23 119.89,107.71 122.48,107.71 124.84,105.35 132.02,105.35 P2.R1 133.79,106.3 134.37,105.73 R3.2
N$24
  Top 0.152: W5500.1 113.63,109.64 115.35,107.93 119.24,107.93 119.76,107.41 122.35,107.41 124.72,105.04 130.42,105.04 P2.R2 132.88,102.58 R2.2
N$25
  Top 0.152: P2.R7 123.64,108.02 120.01,108.02 119.19,108.84 119.19,114.3 118.58,114.91 117.24,114.91 C26.2
N$26
  Top 0.152: W5500.6 114.05,112.14 114.34,112.43 R5.1 C26.1
N$27
  Top 0.152: W5500.5 113.91,111.64 114.43,111.12 R6.1 115.74,110.49 C27.2
N$28  (via drill 0.35)
  Top 0.152: v118.56,109.86 118.43,109.98 117.5,109.98 C27.1 | P2.R8 124.08,105.25 122.22,107.1 118.33,107.1 v118.11,107.32
  Bottom 0.152: v118.56,109.86 118.56,108.53 118.11,108.09 v118.11,107.32
N$29
  Top 0.152: Y3.P$2 80.9,104.52 82.26,103.16 C22.1 83.88,102.87 84.63,103.61 STM32.3
N$30
  Top 0.152: STM32.60 81.68,108.97 80.79,108.97 80.47,108.65 79.06,108.65 79.06,108.74 R30.1
NET_RESET  (via drill 0.35)
  Top 0.152: STM32.25 93.82,110.99 93.92,110.9 95.42,110.9 96.97,109.35 96.97,109.05 v97.41,108.61 | W5500.37 106.22,109.26 106.49,109.54 110.03,109.54 v110.05,109.53
  Bottom 0.152: v97.41,108.61 101.52,104.5 106.78,104.5 110.24,107.95 110.24,109.33 v110.05,109.53
PLTA_ON/OFF  (via drill 0.35)
  Top 0.152: U$3.50 116.2,40.01 71.12,40.01 U$1.50 68.58,40.01 23.62,40.01 U$2.50 21.08,40.01 3.43,40.01 1.33,42.1 1.33,113.86 2.29,114.81 PWR_ON.P$8 6.54,114.81 9.14,112.2 9.14,109.22 9.91,108.46 12.7,108.46 v12.96,108.2 | v17.24,108.33 19.5,108.33 20.32,107.5 v20.32,104.2 | v23.24,103.95 24.57,105.28 SWITCH_CONNECTOR.1
  Bottom 0.152: v12.96,108.2 13.08,108.33 v17.24,108.33 | v20.32,104.2 20.89,103.63 22.92,103.63 v23.24,103.95
PWM_1  (via drill 0.35)
  Top 0.152: U$2.20 12.83,74.3 12.04,75.08 12.04,96.8 11.81,97.03 U$6.P$9 | Q1.3 119,100.62 R26.2 118.96,99.53 v118.94,99.5
  Bottom 0.152: U$2.20 18.77,75.56 63.73,75.56 U$1.20 66.27,75.56 111.35,75.56 U$3.20 113.67,75.34 113.67,77.45 113.98,77.76 113.98,79.86 114.28,80.17 114.28,82.28 114.59,82.58 114.59,84.46 114.89,84.77 114.89,86.88 115.19,87.18 115.19,89.52 115.5,89.83 115.5,91.93 115.81,92.24 115.81,96.37 v118.94,99.5
PWM_2  (via drill 0.35)
  Top 0.152: U$2.21 13.08,76.83 12.34,77.57 12.34,99.31 12.09,99.57 U$6.P$8 | Q5.3 115.82,100.62 R36.2 115.78,99.54 v115.82,99.5
  Bottom 0.152: U$2.21 18.77,78.11 63.73,78.11 U$1.21 66.27,78.11 111.35,78.11 U$3.21 113.67,77.88 113.67,79.99 113.98,80.3 113.98,82.41 114.28,82.71 114.28,84.59 114.59,84.89 114.59,87 114.89,87.31 114.89,89.65 115.19,89.95 115.19,92.06 115.5,92.36 115.5,97.08 115.82,97.41 v115.82,99.5
PWM_3  (via drill 0.35)
  Top 0.152: U$2.22 13.59,79.38 12.65,80.31 12.65,101.85 12.39,102.11 U$6.P$7 | Q2.3 112.65,100.62 R29.2 112.61,99.53 v112.58,99.5
  Bottom 0.152: U$2.22 18.77,80.64 63.73,80.64 U$1.22 66.27,80.64 111.35,80.64 U$3.22 113.67,80.42 113.67,82.53 113.98,82.84 113.98,84.72 114.28,85.02 114.28,87.13 114.59,87.44 114.59,89.77 114.89,90.08 114.89,92.18 115.19,92.49 115.19,96.89 v112.58,99.5
PWM_3V3_1  (via drill 0.35)
  Top 0.152: R25.2 118.35,104.32 Q1.2 118.35,102.22 117.98,101.85 v117.73,101.85 | STM32.61 82.59,108.49 83.31,109.22 v83.31,110.14
  Bottom 0.152: v117.73,101.85 117.73,102.74 116.9,103.57 95.63,103.57 93.41,105.79 92.15,105.79 88.74,109.2 88.03,109.2 87.1,110.14 v83.31,110.14
PWM_3V3_2  (via drill 0.35)
  Top 0.152: R35.2 115.17,104.45 Q5.2 115.19,103.53 115.19,102.23 v114.81,101.85 | STM32.62 82.93,107.99 v84.09,109.16
  Bottom 0.152: v114.81,101.85 114.81,102.62 114.16,103.26 95.5,103.26 93.28,105.49 92.02,105.49 88.61,108.9 87.9,108.9 87.01,109.79 84.72,109.79 v84.09,109.16
PWM_3V3_3  (via drill 0.35)
  Top 0.152: 111.8,104.78 R28.2 | 111.8,104.78 112,104.58 Q2.2 | STM32.35 90.13,115.38 v89.61,114.86 | v111.57,105.73 111.63,105.73 111.8,105.56 111.8,104.78 | v88.52,112.31 88.52,111.14 v90.37,109.29
  Bottom 0.152: v111.57,105.73 110.91,106.39 109.15,106.39 106.95,104.19 100.33,104.19 96.39,108.13 91.53,108.13 v90.37,109.29 | v88.52,112.31 88.9,112.69 88.9,114.15 v89.61,114.86
PWM_3V3_4  (via drill 0.35)
  Top 0.152: Q6.2 108.95,104.45 R37.2 108.75,105.13 v109.35,105.73 | v88.65,114.83 89.27,115.45 89.34,115.45 89.63,115.74 STM32.36 | v88.28,113.22 88.28,112.97 87.71,112.39 87.71,111.38 89.43,109.66 89.43,109.37 v90.51,108.29
  Bottom 0.152: v109.35,105.73 107.5,103.89 100.2,103.89 96.27,107.82 90.98,107.82 v90.51,108.29 | v88.65,114.83 88.61,114.83 88.01,114.24 88.01,113.49 v88.28,113.22
PWM_3V3_5
  Top 0.152: R31.2 105.9,104.45 Q3.2 105.9,102.54 105.66,102.3 95.59,102.3 94.42,103.47 90.84,103.47 90.13,104.18 STM32.14
PWM_3V3_6
  Top 0.152: R39.2 102.86,104.45 Q7.2 102.86,102.86 102.63,102.63 95.69,102.63 94.55,103.78 91.06,103.78 90.63,104.21 STM32.15
PWM_3V3_7
  Top 0.152: R33.2 99.81,104.45 Q4.2 99.82,103.53 99.82,103.12 99.63,102.93 95.82,102.93 94.67,104.08 91.31,104.08 91.13,104.27 STM32.16
PWM_3V3_8  (via drill 0.35)
  Top 0.152: Q8.2 96.43,103.74 R41.2 95.75,105.33 95.33,105.33 v95.03,105.03 | STM32.17 95.75,106.99 v95.95,107.19
  Bottom 0.152: v95.95,107.19 96.33,107.19 97.54,105.98 97.54,105.03 97.16,104.65 95.41,104.65 v95.03,105.03
PWM_4  (via drill 0.35)
  Top 0.152: U$2.23 13.72,81.92 12.95,82.68 12.95,104.27 12.57,104.65 U$6.P$6 | Q6.3 109.6,100.62 R38.2 109.6,100.55 v109.6,99.5
  Bottom 0.152: U$2.23 18.77,83.19 63.73,83.19 U$1.23 66.27,83.19 111.35,83.19 U$3.23 113.67,82.96 113.67,84.84 113.98,85.15 113.98,87.26 114.28,87.56 114.28,89.9 114.59,90.2 114.59,92.31 114.89,92.61 114.89,95.55 113.04,97.41 111.7,97.41 v109.6,99.5
PWM_5  (via drill 0.35)
  Top 0.152: U$2.24 14.22,84.45 13.26,85.42 13.26,106.55 12.62,107.19 U$6.P$5 | Q3.3 106.55,100.62 R32.2 106.51,99.5 v106.55,99.5
  Bottom 0.152: U$2.24 18.77,85.72 63.73,85.72 U$1.24 66.27,85.72 111.35,85.72 U$3.24 112.65,84.45 113.67,85.48 113.67,87.38 113.98,87.69 113.98,90.03 114.28,90.33 114.28,92.44 114.59,92.74 114.59,95.43 112.91,97.1 108.95,97.1 v106.55,99.5
PWM_6  (via drill 0.35)
  Top 0.152: U$2.25 14.1,87 13.56,87.53 13.56,108.86 12.7,109.73 U$6.P$4 | Q7.3 103.5,100.62 R40.2 103.5,100.55 v103.5,99.5
  Bottom 0.152: U$2.25 18.77,88.27 63.73,88.27 U$1.25 66.27,88.27 111.35,88.27 U$3.25 113.67,88.04 113.67,90.15 113.98,90.46 113.98,92.56 114.28,92.87 114.28,95.3 112.78,96.8 106.21,96.8 v103.5,99.5
PWM_7  (via drill 0.35)
  Top 0.152: U$2.26 14.61,89.53 13.87,90.27 13.87,111.1 12.7,112.27 U$6.P$3 | Q4.3 100.46,100.62 R34.2 100.42,99.54 v100.46,99.5
  Bottom 0.152: U$2.26 18.77,90.81 63.73,90.81 U$1.26 66.27,90.81 111.35,90.81 U$3.26 113.67,90.58 113.67,92.69 113.98,93 113.98,95.17 112.66,96.5 103.47,96.5 v100.46,99.5
PWM_8  (via drill 0.35)
  Top 0.152: U$2.27 14.61,92.08 14.17,92.51 14.17,113.33 12.7,114.81 U$6.P$2 | Q8.3 97.28,100.62 R42.2 97.24,99.54 v97.28,99.5
  Bottom 0.152: U$2.27 18.77,93.34 63.73,93.34 U$1.27 66.27,93.34 111.35,93.34 U$3.27 113.67,93.12 113.67,95.05 112.53,96.19 100.6,96.19 v97.28,99.5
RESET  (via drill 0.35)
  Top 0.152: STM32.7 86.61,105.09 86.61,105.76 86.33,106.05 85.66,106.05 85.15,106.55 85.15,107.46 86.14,108.45 86.14,111.34 82,115.48 C23.2 78.46,116.78 77.85,116.78 77.41,116.33 77.41,115.5 76.72,114.81 74.86,114.81 73.6,116.06 v72.47,116.06 | C24.2 63.37,116.69 | 63.37,116.69 R27.1 64.9,115.51 65.41,115 | v70.64,115.76 69.12,115.76 68.36,115 65.41,115 | RESET.3 62.3,116.69 63.37,116.69 | 65.41,115 65.47,114.94 65.47,104.9 64.86,104.29 59.72,104.29 SWDIO/SWDCLK/RESET.15
  Bottom 0.152: v72.47,116.06 72.22,116.06 71.91,115.76 v70.64,115.76
ROBOT_SCL  (via drill 0.35)
  Top 0.152: U$2.29 23.62,95.89 44.83,95.89 | 44.83,95.89 68.58,95.89 U$1.29 71.12,95.89 116.2,95.89 U$3.29 117.54,94.68 138.49,94.68 139.7,95.89 139.7,107.57 141.1,108.97 U$8.P$6 | 3.3V_ROBO_I2C.4 48.2,99.25 44.83,95.89 | STM32.29 93.72,112.99 94.01,112.7 94.01,111.66 94.17,111.51 95.49,111.51 v95.87,111.89 | v112.34,106.24 112.16,106.43 108.97,106.43 108.81,106.27 103.72,106.27 v102.04,107.95
  Bottom 0.152: v95.87,111.89 95.93,111.95 96.52,111.95 99.89,108.58 101.41,108.58 v102.04,107.95 | U$3.29 118.38,95.52 120.29,95.52 R18.2 120.65,95.16 120.65,101.09 117.86,103.89 114.7,103.89 v112.34,106.24
ROBOT_SDA  (via drill 0.35)
  Top 0.152: 3.3V_ROBO_I2C.2 48.2,102.91 46.7,101.41 46.7,98.77 45.39,97.46 23.71,97.46 21.21,94.95 21.21,93.22 U$2.30 23.62,93.34 68.58,93.34 U$1.30 71.12,93.34 116.2,93.34 U$3.30 137.91,92.08 140,94.17 140,105.33 141.1,106.43 U$8.P$5 | STM32.30 93.77,113.49 94.01,113.25 94.01,113.23 94.09,113.16 v95.87,113.16 | v101.98,108.9 104.31,106.58 108.69,106.58 108.84,106.73 111.94,106.73 112.08,106.87 112.97,106.87 v113.35,106.49
  Bottom 0.152: U$3.30 118.6,93.2 121.05,93.2 R17.2 121.54,93.69 121.54,94.85 121.55,94.86 121.55,96.77 120.95,97.36 120.95,101.22 117.98,104.19 115.03,104.19 113.35,105.87 v113.35,106.49 | v101.98,108.9 100.12,108.9 v95.87,113.16
SPARE2
  Top 0.152: U$2.28 14.99,94.61 14.48,95.12 14.48,115.57 12.7,117.35 U$6.P$1
  Bottom 0.152: U$2.28 18.77,95.89 63.73,95.89 U$1.28 66.27,95.89 111.35,95.89 U$3.28
SPARE3
  Top 0.152: U$2.33 23.62,85.72 68.58,85.72 U$1.33 71.12,85.72 116.2,85.72 U$3.33 138.88,84.45 140.92,86.49 140.92,98.06 141.67,98.81 U$8.P$2
SPARE4
  Top 0.152: U$2.34 23.62,83.19 68.58,83.19 U$1.34 71.12,83.19 116.2,83.19 U$3.34 139.44,81.92 141.22,83.7 141.22,95.63 141.86,96.27 U$8.P$1
SPARE5
  Top 0.152: U$2.35 23.62,80.64 68.58,80.64 U$1.35 71.12,80.64 116.2,80.64 U$3.35 144.59,79.38 146.41,81.19 146.41,116.18 146.94,116.71 SWITCH_CONN.P$9
SPARE6
  Top 0.152: U$2.36 23.62,78.11 68.58,78.11 U$1.36 71.12,78.11 116.2,78.11 U$3.36 145.29,76.83 146.71,78.26 146.71,113.41 147.47,114.17 SWITCH_CONN.P$8
SPARE7
  Top 0.152: U$2.43 23.62,60.33 68.58,60.33 U$1.43 71.12,60.33 116.2,60.33 U$3.43 147.41,59.05 148.84,60.49 148.84,96.01 149.22,96.39 SWITCH_CONN.P$1
SPI_CLK
  Top 0.152: STM32.21 92.23,108.99 91.78,108.54 91.78,106.65 92.18,106.25 96.46,106.25 101.23,111.02 103.77,111.02 103.89,111.14 W5500.33
SPI_MISO
  Top 0.152: STM32.22 92.3,109.49 91.47,108.67 91.47,106.53 92.06,105.94 96.58,105.94 101.28,110.64 W5500.34
SPI_MOSI
  Top 0.152: STM32.23 92.36,109.99 91.17,108.79 91.17,106.4 91.93,105.64 96.71,105.64 101.24,110.17 104.76,110.17 W5500.35
SPI_SS
  Top 0.152: W5500.32 104.77,111.63 103.95,111.63 103.64,111.32 101.1,111.32 96.33,106.55 92.31,106.55 92.08,106.78 92.08,108.34 92.24,108.49 STM32.20
SWCLK
  Top 0.152: SWDIO/SWDCLK/RESET.9 66.17,103.5 67.44,104.78 76.33,104.78 77.34,105.79 77.34,111.38 80.46,114.49 STM32.49
SWDIO  (via drill 0.35)
  Top 0.152: STM32.46 84.63,117.3 v84.2,117.73 | v76.28,105.58 77.03,106.33 77.03,111.92 v78.88,113.78
  Bottom 0.152: v84.2,117.73 84.14,117.79 80.9,117.79 78.88,115.78 v78.88,113.78 | SWDIO/SWDCLK/RESET.7 68.71,103.5 69.72,104.52 75.63,104.52 76.28,105.17 v76.28,105.58
SWITCH_1  (via drill 0.35)
  Top 0.152: U$3.38 116.2,73.03 71.12,73.03 U$1.38 68.58,73.03 23.62,73.03 U$2.38 21.08,71.75 19.86,72.97 19.86,95.99 22.17,98.3 22.17,108.2 22.6,108.63 37.61,108.63 39.13,107.12 39.13,105.48 37.97,104.32 33.33,104.32 32.96,104.69 SWITCH_CONNECTOR.3 | U$3.38 145.54,71.75 147.32,73.53 147.32,108.46 147.96,109.09 SWITCH_CONN.P$6 | U$3.38 118.75,70.48 R10.2 | v91.18,118.52 90.68,118.02 90.68,116.47 STM32.34
  Bottom 0.152: SWITCH_CONN.P$6 152.02,110.62 152.02,118.11 151.33,118.8 91.46,118.8 v91.18,118.52
SWITCH_2  (via drill 0.35)
  Top 0.152: U$3.39 116.2,70.48 71.12,70.48 U$1.39 68.58,70.48 23.62,70.48 U$2.39 21.34,69.22 19.56,70.99 19.56,96.18 21.87,98.49 21.87,108.33 22.48,108.94 37.74,108.94 39.43,107.25 39.43,105.35 38.09,104.02 29.4,104.02 28.77,104.65 SWITCH_CONNECTOR.2 | U$3.39 145.86,69.22 147.62,70.98 147.62,105.98 148.2,106.55 SWITCH_CONN.P$5 | U$3.39 118.75,67.94 R11.2 | v89.11,118.86 89.13,118.84 STM32.37
  Bottom 0.152: SWITCH_CONN.P$5 152.32,108.38 152.32,118.24 151.43,119.13 89.38,119.13 v89.11,118.86
SWITCH_3  (via drill 0.35)
  Top 0.152: U$3.40 116.2,67.94 71.12,67.94 U$1.40 68.58,67.94 23.62,67.94 U$2.40 21.34,66.67 19.25,68.76 19.25,96.31 21.57,98.62 21.57,108.46 22.35,109.24 37.86,109.24 39.74,107.37 39.74,105.23 38.17,103.66 29.48,103.66 28.77,102.95 SWITCH_CONNECTOR.6 | SWITCH_CONN.P$4 148.72,104.01 147.93,103.23 147.93,68.3 146.3,66.67 U$3.40 | U$3.40 118.75,65.41 R12.2 | STM32.38 88.63,118.03 87.59,119.06 v87.57,119.06
  Bottom 0.152: SWITCH_CONN.P$4 152.63,106.15 152.63,118.36 151.51,119.48 87.73,119.48 87.57,119.32 v87.57,119.06
SWITCH_4  (via drill 0.35)
  Top 0.152: U$3.41 116.2,65.41 71.12,65.41 U$1.41 68.58,65.41 23.62,65.41 U$2.41 21.34,64.14 18.95,66.52 18.95,96.43 21.26,98.74 21.26,108.58 22.23,109.55 37.99,109.55 40.04,107.5 40.04,105.1 38.29,103.35 33.62,103.35 32.96,102.69 SWITCH_CONNECTOR.7 | SWITCH_CONN.P$3 148.84,101.47 148.23,100.86 148.23,65.63 146.74,64.14 U$3.41 | U$3.41 118.75,62.87 R13.2 | v90.55,111.38 91.44,110.49 STM32.24 | v92.2,116.33 93.22,117.35 93.28,117.35 94.74,118.81 102.66,118.81 v103.92,117.55
  Bottom 0.152: v90.55,111.38 90.06,111.87 90.06,114.31 92.08,116.33 v92.2,116.33 | SWITCH_CONN.P$3 148.97,103 148.97,116.97 147.75,118.19 138.76,118.19 136.91,116.33 133.73,116.33 133.1,116.97 131.57,116.97 130.94,116.33 124.64,116.33 122.78,118.19 112.41,118.19 111.77,117.55 v103.92,117.55
SWITCH_5  (via drill 0.35)
  Top 0.152: U$3.42 116.2,62.87 71.12,62.87 U$1.42 68.58,62.87 23.62,62.87 U$2.42 21.34,61.59 18.64,64.29 18.64,96.56 20.95,98.87 20.95,108.71 22.1,109.85 38.12,109.85 40.34,107.62 40.34,104.97 37.15,101.78 SWITCH_CONNECTOR.8 | SWITCH_CONN.P$2 149.1,98.93 148.54,98.37 148.54,62.97 147.17,61.59 U$3.42 | U$3.42 118.75,60.33 R14.2 | STM32.27 91.06,111.99 v90.66,112.39 | v102.84,117.77 102.11,118.5 95.58,118.5 v93.09,116.01
  Bottom 0.152: v90.66,112.39 90.41,112.65 90.41,114.11 92,115.7 92.77,115.7 v93.09,116.01 | SWITCH_CONN.P$2 148.67,100.76 148.67,116.76 147.55,117.88 138.89,117.88 137.03,116.03 133.87,116.03 132.9,115.06 131.83,115.06 130.86,116.03 124.51,116.03 122.66,117.88 112.53,117.88 111.89,117.24 104.54,117.24 104.24,116.94 103.6,116.94 102.84,117.69 v102.84,117.77
VBUS
  Top 0.152: PROGRAMMING.VBUS 72.85,109.46 74.97,107.34 D5.A
VBUS_3.3  (via drill 0.35)
  Top 0.152: R20.2 R21.1 66.71,108.55 v66.55,108.71 | STM32.42 86.63,117.21 86.04,117.79 v85.79,117.79 | v72.46,115.13 74.11,115.13 74.74,114.49 76.91,114.49 77.99,115.58 77.99,115.75 v78.31,116.06
  Bottom 0.152: v85.79,117.79 85.22,118.36 83.82,118.36 83.55,118.1 80.77,118.1 78.74,116.06 v78.31,116.06 | v66.55,108.71 66.17,109.09 66.17,112.9 68.39,115.13 v72.46,115.13

## Text on the board
Document: GND | Spare 2 | PLTA On/Off | PWM 8 | Control Signal | PWM 7 | Mobo On/Off | PWM 6 | Jestson On/Off | PWM 5 | 5V | Acoustic On/Off | PWM 4 | SWCLK | SWDIO | 12V On/Off | PWM 3 | 3.3V | GND | 5V On/Off | PWM 2 | GND | 3.3V On/Off | PWM 1 | GND | PLTA On/Off | Switch 2 | Switch 3 | Switch 1 | Switch 4 | Kill Switch | Switch 5 | 3.3V | GND | Robot SCL | Robot SDA